# Altium schematic sheet IS31AP2111.SchDoc: IS31AP2111
size A4; Organization: Altium Limited; Address1: L3, 12a Rodborough Rd; Address2: Frenchs Forest; Address3: NSW; Address4: Australia 2086; Revision: 1.0; SheetNumber: 3; SheetTotal: 5; Alumno: Trotta, Igancio; Curso: R1001; Materia: Sistemas de Representación; Docentes: JM Perdomo, E Ipar
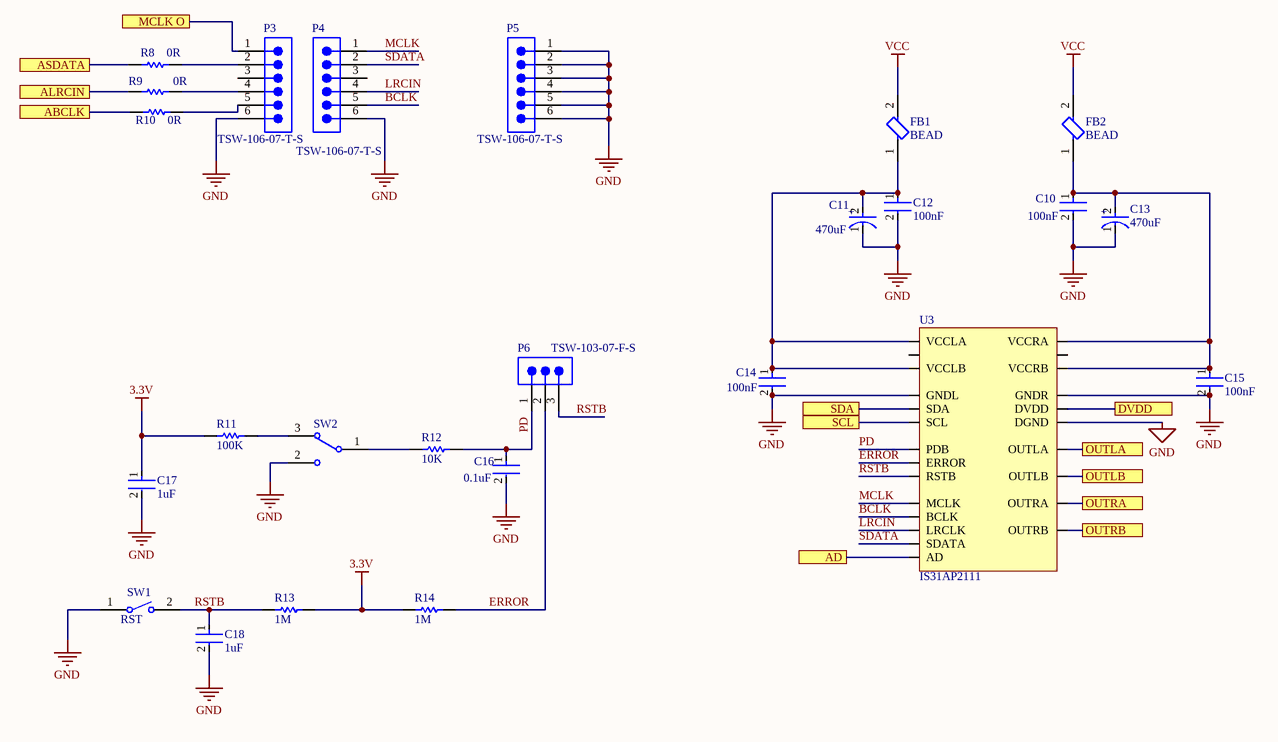
[diagram p0: IS31AP2111.SchDoc]

## Parts
C10  100nF  [FP-CC0603-DA-MFG]
C11  470uF  [FP-UUX0J471MNL1GS-MFG]
C12  100nF  [FP-CC0603-DA-MFG]
C13  470uF  [FP-UUX0J471MNL1GS-MFG]
C14  100nF  [FP-CC0603-DA-MFG]
C15  100nF  [FP-CC0603-DA-MFG]
C16  0.1uF  [FP-CC0603-DA-MFG]
C17  1uF  [FP-CC0603-DA-MFG]
C18  1uF  [FP-CC0603-DA-MFG]
FB1  BEAD  [FP-BLM18-0_15-t0_8-IPC_A]
FB2  BEAD  [FP-BLM18-0_15-t0_8-IPC_A]
P3  TSW-106-07-T-S  [SMTC-TSW-106-07-X-S]
P4  TSW-106-07-T-S  [SMTC-TSW-106-07-X-S]
P5  TSW-106-07-T-S  [SMTC-TSW-106-07-X-S]
P6  TSW-103-07-F-S  [SMTC-TSW-103-07-X-S]
R8  0R  [RESC1608X55X25ML10T15]
R9  0R  [RESC1608X55X25ML10T15]
R10  0R  [RESC1608X55X25ML10T15]
R11  100K  [RESC1608X55X25ML10T15]
R12  10K  [RESC1608X55X25ML10T15]
R13  1M  [RESC1608X55X25LL10T15]
R14  1M  [RESC1608X55X25LL10T15]
SW1  RST  [TECO-FSMSM-2_V]
SW2  450301014042  [450301014042]  (value not drawn)
U3  IS31AP2111  [eTSSOP-24]

## Ports
ABCLK, AD, ALRCIN, ASDATA, DVDD, MCLK O, OUTLA, OUTLB, OUTRA, OUTRB, SCL, SDA

## Nets
3.3V: C17.1 R11.1 R13.2 R14.1
GND: C10.2 C11.1(C) C12.2 C13.1(C) C14.2 C15.2 C16.2 C17.2 C18.2 P3.6 P4.6 P5.1 P5.2 P5.3 P5.4 P5.5 P5.6 SW1.1 SW2.2 U3.8(DGND) U3.16(GNDR) U3.21(GNDL)
VCC: FB1.2 FB2.2
ABCLK: R10.1 ; port ABCLK
AD: U3.10(AD) ; port AD
ALRCIN: R9.1 ; port ALRCIN
ASDATA: R8.1 ; port ASDATA
BCLK: P4.5 U3.12(BCLK)
DVDD: U3.9(DVDD) ; port DVDD
ERROR: P6.2 R14.2 U3.2(ERROR)
LRCIN: P4.4 U3.4(LRCLK)
MCLK: P4.1 U3.11(MCLK)
MCLK O: P3.1 ; port MCLK O
OUTLA: U3.22(OUTLA) ; port OUTLA
OUTLB: U3.20(OUTLB) ; port OUTLB
OUTRA: U3.15(OUTRA) ; port OUTRA
OUTRB: U3.17(OUTRB) ; port OUTRB
PD: C16.1 P6.1 R12.2 U3.1(PDB)
RSTB: C18.1 P6.3 R13.1 SW1.2 U3.7(RSTB)
SCL: U3.6(SCL) ; port SCL
SDA: U3.5(SDA) ; port SDA
SDATA: P4.2 U3.3(SDATA)
NetC10_1: C10.1 C13.2(A) C15.1 FB2.1 U3.13(VCCRA) U3.18(VCCRB)
NetC11_2: C11.2(A) C12.1 C14.1 FB1.1 U3.19(VCCLB) U3.24(VCCLA)
NetP3_2: P3.2 R8.2
NetP3_4: P3.4 R9.2
NetP3_5: P3.5 R10.2
NetR11_2: R11.2 SW2.3
NetR12_1: R12.1 SW2.1

Not connected (* = marked no-connect by the designer): P3 3; P4 3; U3 14 23

## Notes on the sheet
- Title:
- Revision:
- Alumno:
- Materia:
- Docentes:
- Curso:
- File:
- Date:
- Sheet
- of
- (in symbol CMP-12462-000017-1) +

## Library data of the parts
C10 C12 C14-C18 = CMP-2100-03600-2: CAP CER 10000PF 50V X7R 0603; Manufacturer Part Number: CC0603KRX7R9BB103; Manufacturer: YAGEO; Tolerance: 0.1; Material: Ceramic; Temperature Coefficient: 15%; Description: CC0603 10 nF X7R 10.00% 50 V; Value: 10 nF; Mouser Description: Multilayer Ceramic Capacitor, CC Series, 0.01 - F, - 10%, X7R, 50 V, 0603 [1608 Metric]; Digikey Description: CAP CER 10000PF 50V X7R 0603; Height: 0.9mm; Category: Cap; Temperature Characteristic: X7R; Footprint Url: http://www.yageo.com/exep/pages/download/literatures/UPY-C_GEN_24.pdf; Lead Free: Yes; Voltage Rating: 50 V; Temperature: -55°C to +125°C; Device Class L3: Ceramic Capacitors; ComponentLink2Description: Datasheet; Voltage: 50 V; Package: CC0603-DA; Octopart: https://octopart.com/cc0603krx7r9bb103-yageo-192938; Automotive: No; Temperature Range High: +125°C; Temperature Range Low: -55°C; RoHS: TRUE; Device Class L1: Passive Components; ComponentLink2URL: http://www.yageo.com/documents/recent/UPY-GPHC_X7R_6.3V-to-50V_18.pdf; Device Class L2: Capacitors; Capacitance: 10 nF
C11 C13 = CMP-12462-000017-1: CAP ALUM 470UF 20% 6.3V SMD; Leakage Current: 88.83uA; Life (Hours): 2000Hour; Ripple Current: 340mA; Termination: SMD/SMT; Case/Package: Radial; Package Quantity: 1; Height: 10mm; Min Operating Temperature: -55°C; Radiation Hardening: No; Tolerance: 20%; Length: 10mm; Capacitance: 470uF; Height - Seated (Max): 0.394inch; Features: General Purpose; Voltage Rating (DC): 6.3V; Max Operating Temperature: 105°C; Mount: Surface Mount; Packaging: Tape and Reel; Voltage Rating: 6.3V; Diameter: 10mm
FB1 FB2 = CMP-0686-00557-7: Chip Ferrite Bead, 0603, 120Ω @ 100MHz, 0.05Ω, 25%, 2A; Impedance: 120R; Number of Circuits: 1; Shielding: Unshielded; Material: Steel; DC Resistance (DCR): 50mR; Case Code (Imperial): 0603; RoHS Compliant: Yes; Number of Pins: 2; Min Operating Temperature: -55°C; Case Code (Metric): 1608; Frequency: 100MHz; Length: 1.6mm; Test Frequency: 100MHz; Max Operating Temperature: 125°C; Packaging: Tape and Reel; Max Current Rating: 2A; Termination: SMD/SMT; Lead Free: Lead Free; Max DC Current: 2A; Case/Package: 0603; Height: 0.8mm; Current Rating: 2A; Radiation Hardening: No; Core Material: Ferrite; DC Current: 2A; REACH SVHC: No SVHC; Package Quantity: 1; Depth: 0.8mm; Number of Lines: 1; Tolerance: 25%; Width: 0.8mm
P3-P5 = CMP-1024-00384-1: 0.025" SQ Post Header, Through-hole, Vertical, -55 to 105 degC, 2.54 mm Pitch, 6-Pin, Male, RoHS; Manufacturer: Samtec; Pitch: 2.54 mm; ComponentLink3URL: http://www.samtec.com/documents/webfiles/cpdf/TSW-XXX-XX-XXX-X-XX-XXX-MKT.pdf; ComponentLink1Description: Manufacturer URL; Orientation: Vertical; ComponentLink2Description: Datasheet; ComponentLink1URL: http://www.samtec.com; RoHS: True; DatasheetVersion: F-214; PackageDescription: .025[0.64] SQ. Post Terminal Strip Assembly; PartNumber: TSW-106-07-T-S; Mounting Technology: Through-hole; PackageReference: TSW-106-07-X-S; PackageVersion: DM, 8/1988; ComponentLink3Description: Package Specification; ComponentLink2URL: http://www.samtec.com/documents/webfiles/pdf/TSW_TH.PDF; Temperature Range: -55 to 105 degC
P6 = CMP-1024-00331-1: 0.025" SQ Post Header, Through-hole, Vertical, -55 to 125 degC, 2.54 mm Pitch, 3-Pin, Male, RoHS; Manufacturer: Samtec; Pitch: 2.54 mm; DatasheetVersion: F-214; ComponentLink1Description: Manufacturer URL; ComponentLink3URL: http://www.samtec.com/documents/webfiles/cpdf/TSW-XXX-XX-XXX-X-XX-XXX-MKT.pdf; Mounting Technology: Through-hole; PackageDescription: .025[0.64] SQ. Post Terminal Strip Assembly; Temperature Range: -55 to 125 degC; ComponentLink3Description: Package Specification; Orientation: Vertical; PartNumber: TSW-103-07-F-S; RoHS: True; PackageVersion: DM, 8/1988; ComponentLink2Description: Datasheet; ComponentLink1URL: http://www.samtec.com; ComponentLink2URL: http://www.samtec.com/documents/webfiles/pdf/TSW_TH.PDF; PackageReference: TSW-103-07-X-S
R8-R12 = CMP-2000-05021-1: Chip Resistor, 100 Ohm, +/- 5%, 50 V, 0603 (1608 Metric), RoHS, Tape and Reel; Manufacturer: Yageo; Temperature Coefficient: 100PPM/C; Resistance: 100Ohms; Power Rating: 100mW; Voltage Rating: 50V; Manufacturer URL: http://www.yageo.com/; Product: ThickFilmResistorsGeneralPurpose; Package Description: 2-Pin Surface Mount Device, Body 1.6 x 0.8 mm; Tolerance: 5%; Termination Style: SMD/SMT; Datasheet URL: http://www.farnell.com/datasheets/443971.pdf; Operating Temperature Range: -55Cto+155C; Packaging: Reel; Case Code - in: 0603; Package Reference: 603; Series: RC; Case Code - mm: 1608; Datasheet Version: Rev. 4, 04/2009
R13 R14 = CMP-2000-06953-1: General Purpose Chip Resistor, 1 MOhm, +/- 5%, -55 to 155 degC, 0603 (1608 Metric), RoHS, Tape and Reel; Manufacturer: Yageo; Power Rating: 100mW; Product Range: RCSeries; Temperature Coefficient: ±100ppm/°C; Resistor Element Type: ThickFilm; Resistance: 1Mohm; SVHC: ToBeAdvised; Voltage Rating: 50V; Resistor Case Style: 0603[1608Metric]; MSL: MSL1-Unlimited; Package Description: 2-Pin Surface Mount Device, Body 1.6 x 0.8 mm; Resistance Tolerance: ±5%; Datasheet Version: Rev. 7, 05/2017; Datasheet URL: http://www.yageo.com/documents/recent/PYu-RC_Group_51_RoHS_L_7.pdf; Manufacturer URL: http://www.yageo.com/; Package Reference: 0603; Automotive Qualification Standard: -; Packaging: CutTape; Mounting Technology: SurfaceMount
SW1 = CMP-2000-07511-1: FSMSM Push Button Switch, 50 mA, -35 to 85 degC, 2-Pin SMD, RoHS, Bulk; Manufacturer: TE Connectivity; Actuator Length: 1.07mm; Electrical Life: 20000Cycles; Actuator Material: Polyamide; Current Rating: 50mA; Illumination Type: Illuminated; Voltage Rating (DC): 24V; Contact Resistance: 100mOhm; Case\/Package: SMD/SMT; Operating Force: 180gf; Switch Travel: 0.25mm; Max Voltage Rating (DC): 12V; Throw Configuration: SPST; Packaging: LoosePiece; Max Operating Temperature: 85degC; ELV: Compliant; Package Description: 2-Pin Surface Mount Device, Body 6 x 3.5 mm, Pitch 9.19 mm; RoHSCompliant: true; Manufacturer URL: http://www.te.com/; Contact Plating: Silver; Contact Material: Brass; Mounting Technology: SurfaceMount; Contact Current Rating: 50mA; Datasheet Version: Rev. C2, 08/2014; Datasheet URL: http://www.te.com/commerce/DocumentDelivery/DDEController?Action=showdoc&DocId=Customer+Drawing%7F1437566-3%7FC2%7Fpdf%7FEnglish%7FENG_CD_1437566-3_C2_1437566_3_1_c.dwg.pdf%7F1437566-3; Mechanical Life: 20000Cycles; Package Reference: FSMSM; REACH SVHC: Unknown; Orientation: Straight; Min Operating Temperature: -35degC; Lead Free: LeadFree; Termination: GullWing; Package Quantity: 1000; Mount: SurfaceMount
SW2 = CMP-1466-00001-1: WS-SLTV 10mm*2.5mm, SPDT, ON-ON, 2.54mm, straight type, THT, Mini Slide Switch, 3 pins; Manufacturer: Wuerth Elektronik; NoPins: 06; ComponentLink2URL: http://katalog.we-online.de/em/datasheet/450301014042.pdf; PartNumber: 450301014042; ComponentLink1Description: Manufacturer URL; ComponentLink2Description: Datasheet; PackageReference: 450301014042; ComponentLink1URL: http://www.we-online.com
U3 = IS31AP2111_Trotta: 2x20W STEREO/1x40W MONO DIGITAL (I2S) AUDIO AMPLIFIER WITH 20 BANDS EQ FUNCTIONS